# Altium schematic sheet mcu.SchDoc
size A4
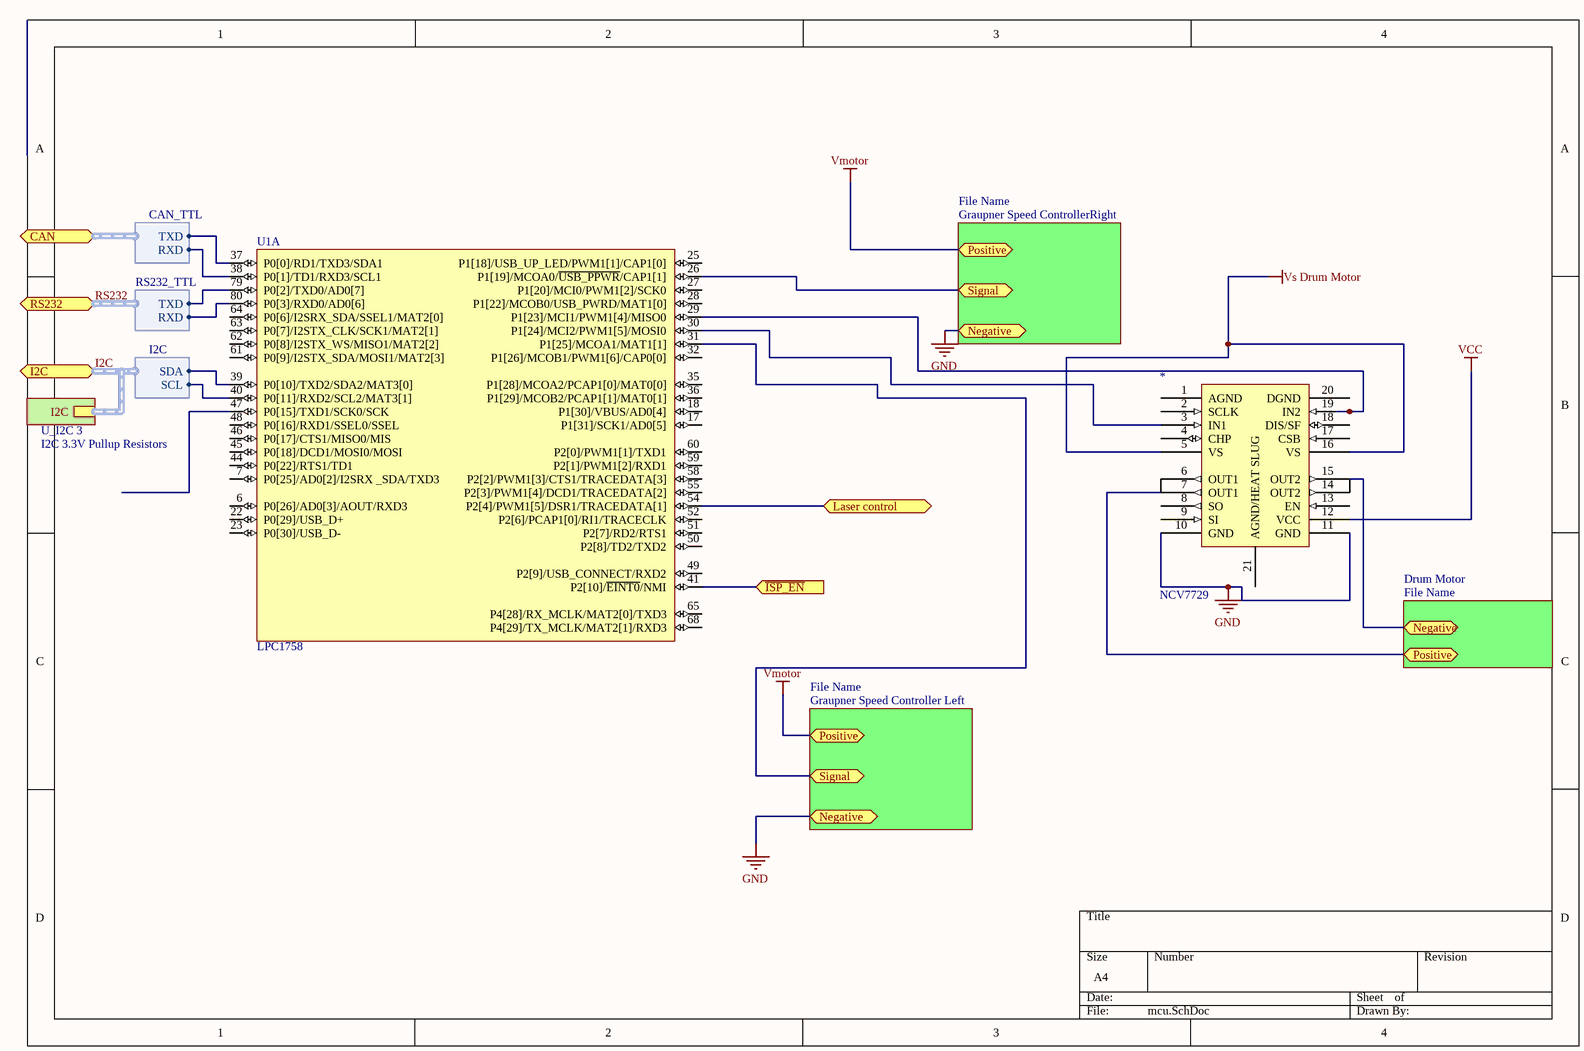
[diagram p0: mcu.SchDoc]

## Parts
*  NCV7729  [NCV7729]
U1  LPC1758  [LPC1758FBD80]  (part A of 3)

## Sub-sheets
Drum Motor = File Name: no entries
Graupner Speed Controller Left = File Name: no entries
Graupner Speed ControllerRight = File Name: no entries
U_I2C 3 = I2C 3.3V Pullup Resistors: I2C (harness I2C)

## Ports
CAN (harness CAN_TTL), I2C (harness I2C), Laser control, Negative, Positive, RS232 (harness RS232_TTL), Signal, ~{ISP_EN} (in)

## Harnesses
CAN_TTL: RXD, TXD
I2C: SCL, SDA
RS232_TTL: RXD, TXD

## Nets
GND: *.10(GND) *.11(GND) *.15(OUT2) ; port Negative
VCC: *.12(VCC)
Vmotor: *.7(OUT1) ; port Positive
Vs Drum Motor: *.5(VS) *.16(VS)
I2C.SCL: U1.40(P0[11]/RXD2/SCL2/MAT3[1]) ; port I2C.SCL
I2C.SDA: U1.39(P0[10]/TXD2/SDA2/MAT3[0]) ; port I2C.SDA
~{ISP_EN}: U1.41(P2[10]/~{EINT0}/NMI) ; port ~{ISP_EN}
Laser control: U1.54(P2[4]/PWM1[5]/DSR1/TRACEDATA[1]) ; port Laser control
RS232.RXD: U1.80(P0[3]/RXD0/AD0[6]) ; port RS232.RXD
RS232.TXD: U1.79(P0[2]/TXD0/AD0[7]) ; port RS232.TXD
Signal: U1.26(P1[19]/MCOA0/~{USB_PPWR}/CAP1[1]) U1.31(P1[25]/MCOA1/MAT1[1]) ; port Signal
Net*_3: *.3(IN1) U1.30(P1[24]/MCI2/PWM1[5]/MOSI0)
Net*_19: *.19(IN2) U1.29(P1[23]/MCI1/PWM1[4]/MISO0)
NetU1_37: U1.37(P0[0]/RD1/TXD3/SDA1) ; port CAN.TXD
NetU1_38: U1.38(P0[1]/TD1/RXD3/SCL1) ; port CAN.RXD

Not connected (* = marked no-connect by the designer): * 1(AGND) 2(SCLK) 4(CHP) 6(OUT1) 8(SO) 9(SI) 13(EN) 14(OUT2) 17(CSB) 18(DIS/SF) 20(DGND) 21(AGND/HEAT_SLUG); U1 6(P0[26]/AD0[3]/AOUT/RXD3) 7(P0[25]/AD0[2]/I2SRX__SDA/TXD3) 17(P1[31]/SCK1/AD0[5]) 18(P1[30]/VBUS/AD0[4]) 22(P0[29]/USB_D+) 23(P0[30]/USB_D-) 25(P1[18]/USB_UP_LED/PWM1[1]/CAP1[0]) 27(P1[20]/MCI0/PWM1[2]/SCK0) 28(P1[22]/MCOB0/USB_PWRD/MAT1[0]) 32(P1[26]/MCOB1/PWM1[6]/CAP0[0]) 35(P1[28]/MCOA2/PCAP1[0]/MAT0[0]) 36(P1[29]/MCOB2/PCAP1[1]/MAT0[1]) 44(P0[22]/RTS1/TD1) 45(P0[18]/DCD1/MOSI0/MOSI) 46(P0[17]/CTS1/MISO0/MIS) 47(P0[15]/TXD1/SCK0/SCK) 48(P0[16]/RXD1/SSEL0/SSEL) 49(P2[9]/USB_CONNECT/RXD2) 50(P2[8]/TD2/TXD2) 51(P2[7]/RD2/RTS1) 52(P2[6]/PCAP1[0]/RI1/TRACECLK) 55(P2[3]/PWM1[4]/DCD1/TRACEDATA[2]) 58(P2[2]/PWM1[3]/CTS1/TRACEDATA[3]) 59(P2[1]/PWM1[2]/RXD1) 60(P2[0]/PWM1[1]/TXD1) 61(P0[9]/I2STX_SDA/MOSI1/MAT2[3]) 62(P0[8]/I2STX_WS/MISO1/MAT2[2]) 63(P0[7]/I2STX_CLK/SCK1/MAT2[1]) 64(P0[6]/I2SRX_SDA/SSEL1/MAT2[0]) 65(P4[28]/RX_MCLK/MAT2[0]/TXD3) 68(P4[29]/TX_MCLK/MAT2[1]/RXD3)

## Buses and harness runs
harness I2C = port I2C = sheet U_I2C 3/I2C
harness RS232 = port RS232

## Library data of the parts
U1 = LPC1758: NXP - LPC1758FBD80 - MCU, 32BIT, ARM CORTEX M3, 80LQFP; farnell: 1718545